# EAGLE design v1 (EAGLE 6.4)
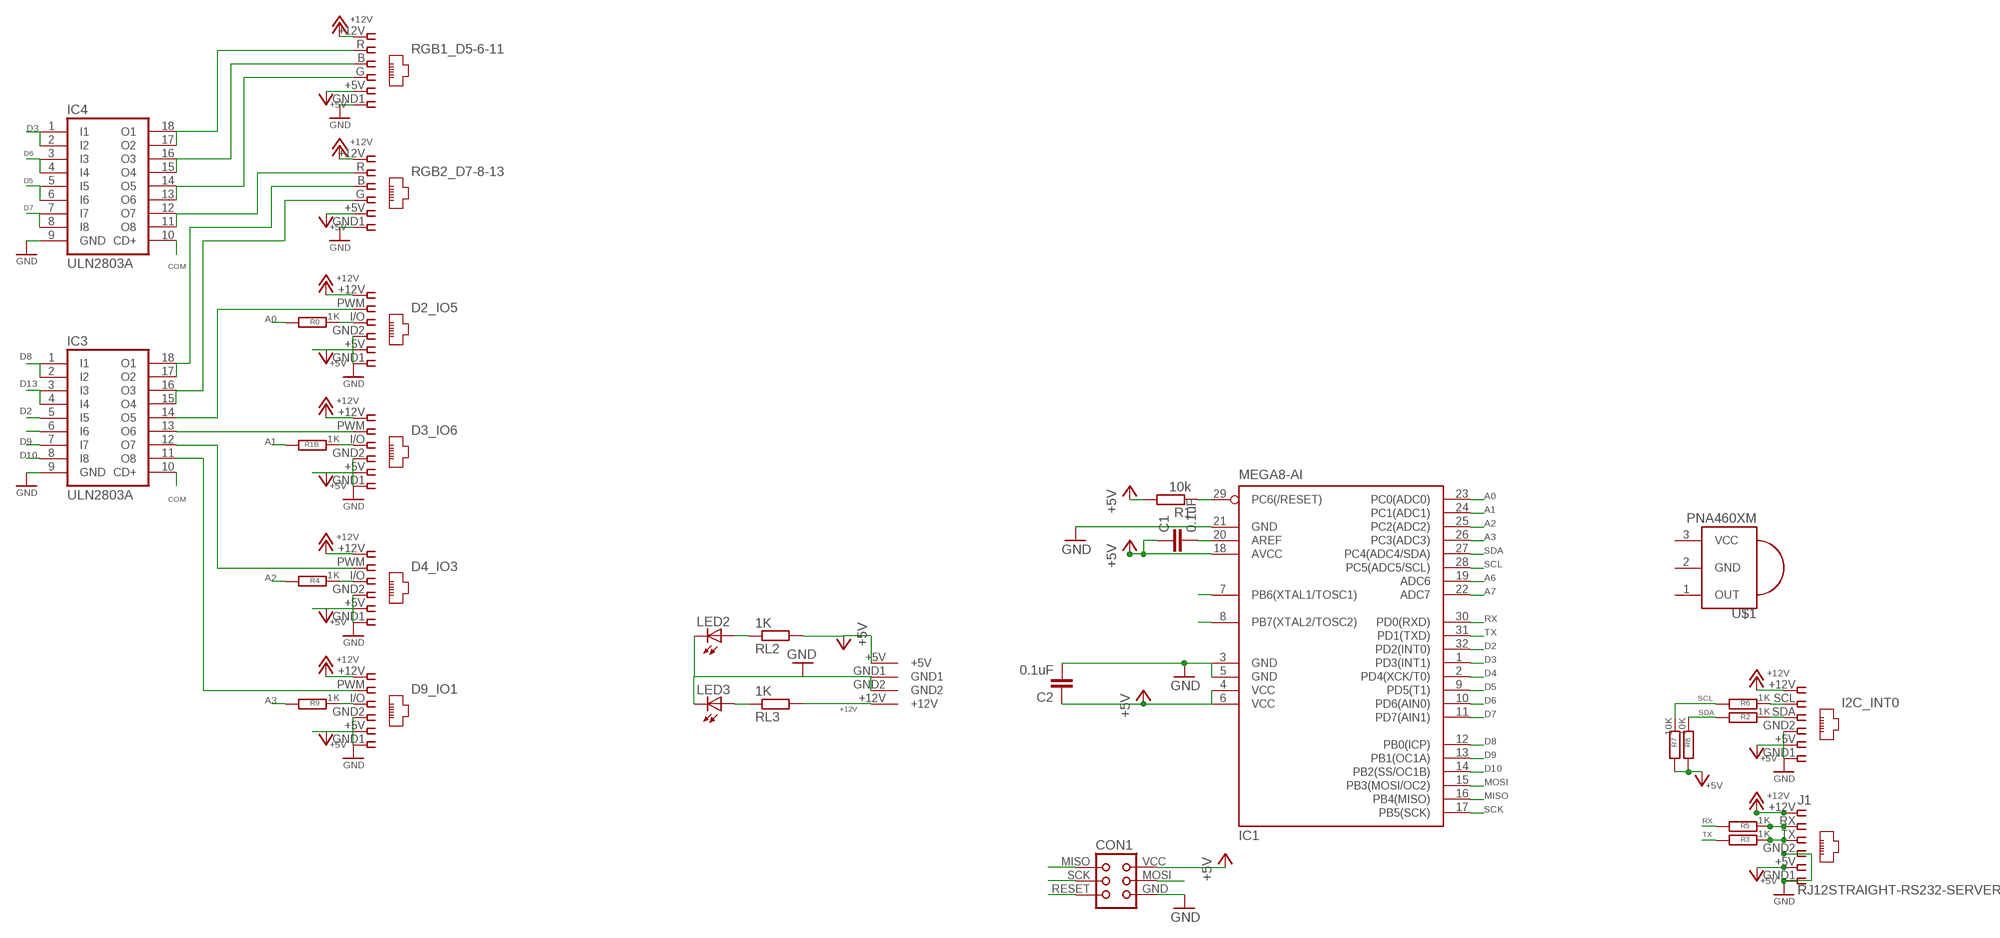
[diagram p0: schematic, sheet 1]

## Parts
C1  0.1uF  C-EUC1206  [C1206]
C2  0.1uF  C-EUC1206  [C1206]
CON1  TINYISP  [TINYISP]
D2_IO5  IO5  RJ12STRAIGHT  [RJ12-STRAIGHT]
D3_IO6  IO6  RJ12STRAIGHT  [RJ12-STRAIGHT]
D4_IO3  IO3  RJ12STRAIGHT  [RJ12-STRAIGHT]
D9_IO1  IO1  RJ12STRAIGHT  [RJ12-STRAIGHT]
I2C_INT0  I2C  RJ12STRAIGHT-I2C  [RJ12-STRAIGHT-I2C]
IC1  MEGA8-AI  [TQFP32-08]
IC3  ULN2803A  [SO18W]
IC4  ULN2803A  [SO18W]
J1  RJ12STRAIGHT-RS232-SERVER  [RJ12-STRAIGHT-RS232]
LED2  LED3MM  [LED3MM]
LED3  LED3MM  [LED3MM]
R0  1K  R-EU_M1206  [M1206]
R1  10k  R-EU_M1206  [M1206]
R1B  1K  R-EU_M1206  [M1206]
R2  1K  R-EU_M1206  [M1206]
R3  1K  R-EU_M1206  [M1206]
R4  1K  R-EU_M1206  [M1206]
R5  1K  R-EU_M1206  [M1206]
R6  1K  R-EU_M1206  [M1206]
R7  10K  R-EU_M1206  [M1206]
R8  10K  R-EU_M1206  [M1206]
R9  1K  R-EU_M1206  [M1206]
RGB1_D5-6-11  RGB1  RJ12STRAIGHT-RGB  [RJ12-STRAIGHT-RGB]
RGB2_D7-8-13  RGB2  RJ12STRAIGHT-RGB  [RJ12-STRAIGHT-RGB]
RL2  1K  R-EU_M1206  [M1206]
RL3  1K  R-EU_M1206  [M1206]
U$1  PNA460XM  [PNA460XM]
U$2  KPJX-4S-S  [KPJX-4S-S]

## Nets
+5V [power]: C1.1 C2.1 CON1.VCC D2_IO5.+5V D3_IO6.+5V D4_IO3.+5V D9_IO1.+5V I2C_INT0.+5V IC1.4(VCC) IC1.6(VCC) IC1.18(AVCC) J1.+5V R1.2 R7.2 R8.2 RGB1_D5-6-11.+5V RGB2_D7-8-13.+5V RL2.2 U$2.+5V
+12V [highpower]: D2_IO5.+12V D3_IO6.+12V D4_IO3.+12V D9_IO1.+12V I2C_INT0.+12V J1.+12V RGB1_D5-6-11.+12V RGB2_D7-8-13.+12V RL3.2 U$2.+12V
A0: IC1.23(PC0(ADC0)) R0.2
A1: IC1.24(PC1(ADC1)) R1B.2
A2: IC1.25(PC2(ADC2)) R4.2
A3: IC1.26(PC3(ADC3)) R9.2
A6: IC1.19(ADC6)
A7: IC1.22(ADC7)
COM: IC3.10(CD+) IC4.10(CD+)
D2: IC1.32(PD2(INT0)) IC3.5(I5)
D2B: D4_IO3.I/O R4.1
D2B1: D9_IO1.I/O R9.1
D2B4: I2C_INT0.SDA R2.1
D2B5: J1.TX R3.1
D2B6: D2_IO5.I/O R0.1
D2B7: D3_IO6.I/O R1B.1
D3: IC1.1(PD3(INT1)) IC4.1(I1) IC4.2(I2)
D4: IC1.2(PD4(XCK/T0))
D5: IC1.9(PD5(T1)) IC4.5(I5) IC4.6(I6)
D6: IC1.10(PD6(AIN0)) IC4.3(I3) IC4.4(I4)
D7: IC1.11(PD7(AIN1)) IC4.7(I7) IC4.8(I8)
D8: IC1.12(PB0(ICP)) IC3.1(I1) IC3.2(I2)
D9: IC1.13(PB1(OC1A)) IC3.7(I7)
D10: IC1.14(PB2(SS/OC1B)) IC3.8(I8)
D13: IC3.3(I3) IC3.4(I4)
GND [power]: C2.2 CON1.GND D2_IO5.GND1 D2_IO5.GND2 D3_IO6.GND1 D3_IO6.GND2 D4_IO3.GND1 D4_IO3.GND2 D9_IO1.GND1 D9_IO1.GND2 I2C_INT0.GND1 I2C_INT0.GND2 IC1.3(GND) IC1.5(GND) IC1.21(GND) IC3.9(GND) IC4.9(GND) J1.GND1 J1.GND2 LED2.K(C) LED3.K(C) RGB1_D5-6-11.GND1 RGB2_D7-8-13.GND1 U$2.GND1 U$2.GND2
MISO: CON1.MISO IC1.16(PB4(MISO))
MOSI: CON1.MOSI IC1.15(PB3(MOSI/OC2))
N$1: IC3.6(I6)
N$2: D3_IO6.PWM IC3.13(O6)
N$4: C1.2 IC1.20(AREF)
N$22 [power]: D4_IO3.PWM IC3.12(O7)
N$26: IC1.7(PB6(XTAL1/TOSC1))
N$27: IC1.8(PB7(XTAL2/TOSC2))
N$48 [power]: IC3.17(O2) IC3.18(O1) RGB2_D7-8-13.B
N$49 [power]: IC4.17(O2) IC4.18(O1) RGB1_D5-6-11.R
N$50 [power]: IC4.15(O4) IC4.16(O3) RGB1_D5-6-11.B
N$51 [power]: D9_IO1.PWM IC3.11(O8)
N$57 [power]: IC3.15(O4) IC3.16(O3) RGB2_D7-8-13.G
N$60 [power]: D2_IO5.PWM IC3.14(O5)
N$68 [power]: IC4.13(O6) IC4.14(O5) RGB1_D5-6-11.G
N$69 [power]: IC4.11(O8) IC4.12(O7) RGB2_D7-8-13.R
N$70: J1.RX R5.1
N$71: I2C_INT0.SCL R6.1
N$75: LED3.A RL3.1
N$76: LED2.A RL2.1
RESET: CON1.RESET IC1.29(PC6(/RESET)) R1.1
RX: IC1.30(PD0(RXD)) R5.2
SCK: CON1.SCK IC1.17(PB5(SCK))
SCL: IC1.28(PC5(ADC5/SCL)) R6.2 R7.1
SDA: IC1.27(PC4(ADC4/SDA)) R2.2 R8.1
TX: IC1.31(PD1(TXD)) R3.2
Unconnected: U$1.1(OUT)

## Power pins joined to a net without a drawn wire
GND: U$1.2(GND)
VCC: U$1.3(VCC)

## Library data of the parts
C1 C2 = resistor:C-EU: CAPACITOR, European symbol
CON1 = lpatiny:TINYISP: CONNECTOR; OC_FARNELL: unknown; OC_NEWARK: unknown
D2_IO5 D3_IO6 D4_IO3 D9_IO1 I2C_INT0 J1 RGB1_D5-6-11 RGB2_D7-8-13 = lpatiny:RJ12: CORCOM Modular RJ Jacks No Shield Source: www.tycoelectronics.com .. ENG_DS_1654001_1099_RJ_L_0507.pdf
IC1 = atmel:MEGA8: MICROCONTROLLER 8 Kbytes FLASH, 1 kbytes SRAM, 512 bytes EEPROM, USART, 6-channel 10 bit ADC, 2-channel 8 bit ADC Pin compatible with Atmega48, ATMega88, ATMega168 Source: avr.lbr; MPN: ATMEGA8-16AU; OC_FARNELL: 9171371; OC_NEWARK: 73M8863
IC3 IC4 = lpatiny:ULN2803A: DRIVER ARRAY
LED2 LED3 = lpatiny:LED3MM
R0 R1 R1B R2-R9 RL2 RL3 = resistor:R-EU_: RESISTOR, European symbol
U$1 = adafruit:PNA460XM: IR 38KHz receiver PNA4602 and related receivers http://www.ladyada.net/library/pcb/eaglelibrary.html
U$2 = lpatiny:KPJX-4S-S

## Net classes
0 default: width 0.203 mm
1 power: width 0.457 mm
2 highpower: width 0.61 mm

## Board
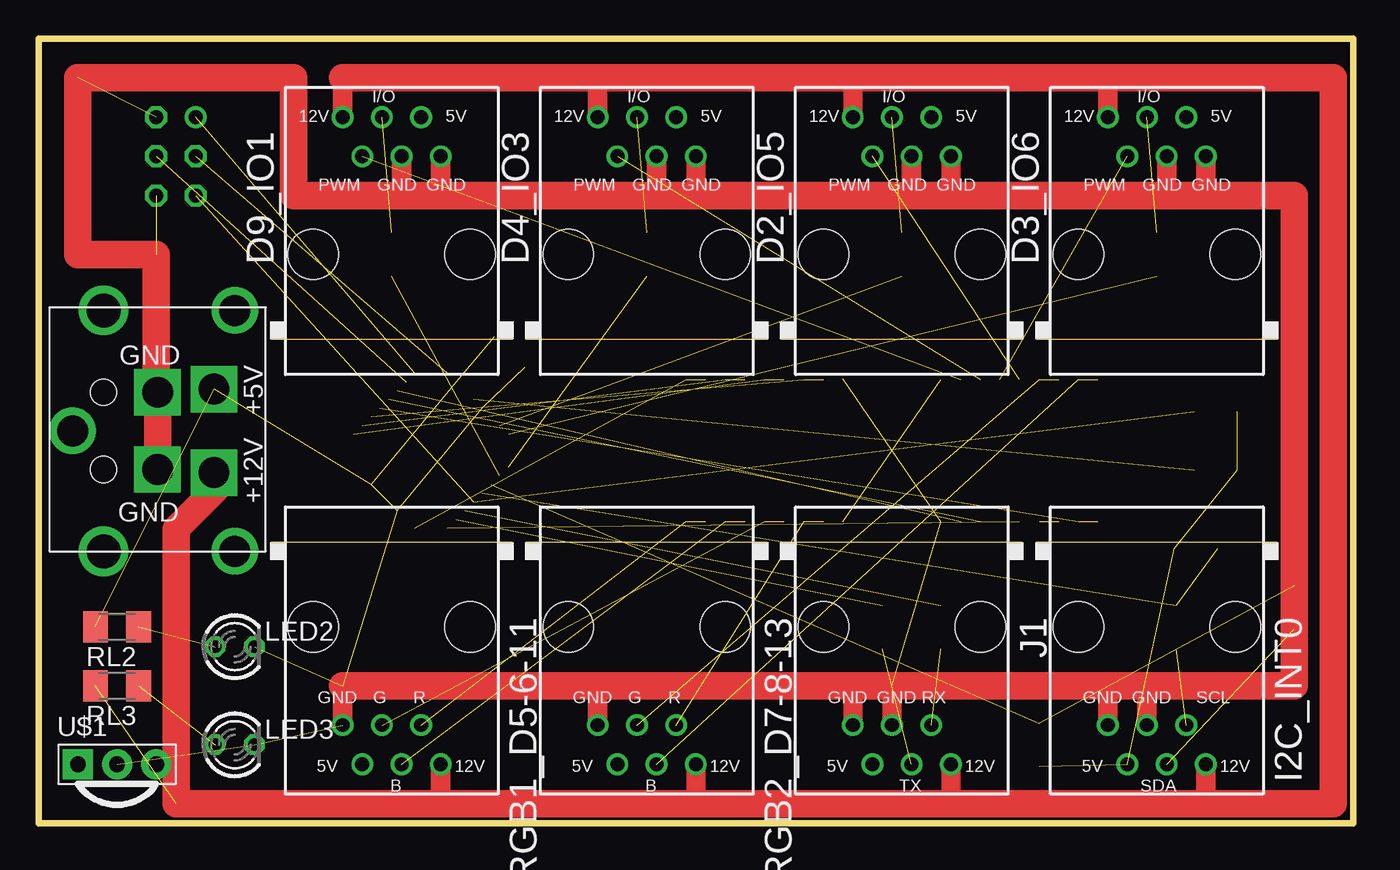
[diagram p1: board, top side]
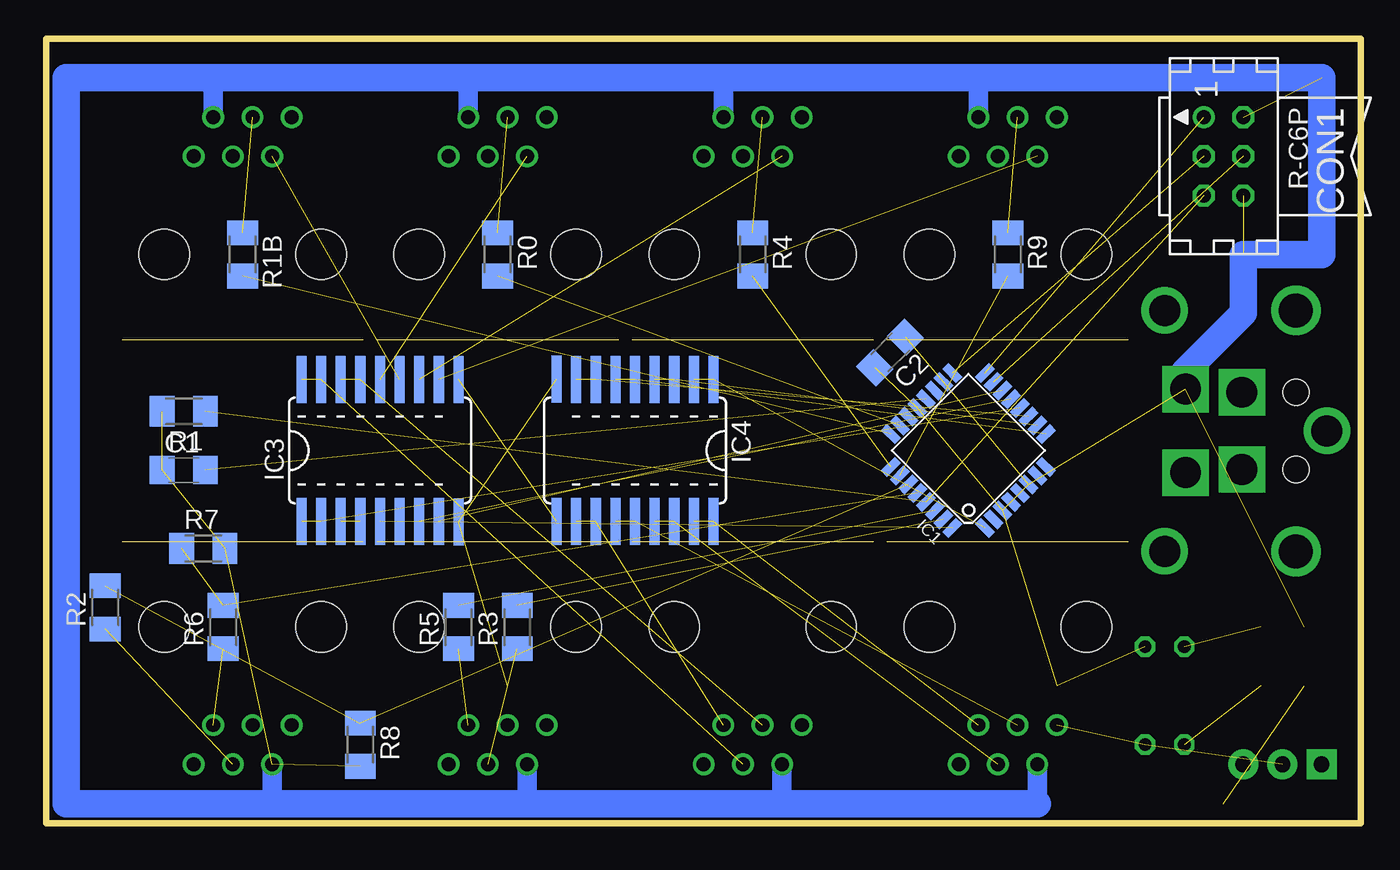
[diagram p2: board, bottom side, seen from below]

Size 85.09 x 50.8 mm. Coordinates in mm from the lower left corner, seen from the top.
Outline: 0,0 0,50.8 85.09,50.8 85.09,0 0,0
Copper layers (1*16): Top 0.035mm / dielectric 1.5mm / Bottom 0.035mm
Design rules "default": minimum track width 10mil, minimum drill 24mil, track to track 8mil, track to pad 8mil, pad to pad 8mil, via to via 8mil, smd to smd 8mil, copper to edge 40mil, drill to drill 8mil, minimum pad ring 10mil, minimum via ring 8mil, stop-mask expansion 4mil, vias tented up to drill 0mil, thermal gap 10mil
vRestrict: area 88.9,22.9 to 101.6,35.6

### Footprints (pad centres in the part's own frame; a part is rotated, then mirrored left to right if it is on the bottom)
C1206 = smd 1.6 x 1.8: 1 -1.4,0; 2 1.4,0
TINYISP = drill 0.914 octagon: GND 2.54,1.27; MOSI 0,1.27; RESET 2.54,-1.27; SCK 0,-1.27; VCC -2.54,1.27 | drill 0.914: MISO -2.54,-1.27
RJ12-STRAIGHT = drill 0.9 pad 1.4: +5V 1.905,8.89; +12V -3.175,8.89; GND1 3.175,6.35; GND2 0.635,6.35; I/O -0.635,8.89; PWM -1.905,6.35 | hole 3.251: -5.08,0; 5.08,0
RJ12-STRAIGHT-I2C = drill 0.9 pad 1.4: +5V 1.905,8.89; +12V -3.175,8.89; GND1 3.175,6.35; GND2 0.635,6.35; SCL -1.905,6.35; SDA -0.635,8.89 | hole 3.251: -5.08,0; 5.08,0
TQFP32-08 = smd 1.27 x 0.559: 1 -4.293,2.8; 2 -4.293,2; 3 -4.293,1.2; 4 -4.293,0.4; 5 -4.293,-0.4; 6 -4.293,-1.2; 7 -4.293,-2; 8 -4.293,-2.8; 17 4.293,-2.8; 18 4.293,-2; 19 4.293,-1.2; 20 4.293,-0.4; 21 4.293,0.4; 22 4.293,1.2; 23 4.293,2; 24 4.293,2.8 | smd 0.559 x 1.27: 9 -2.8,-4.293; 10 -2,-4.293; 11 -1.2,-4.293; 12 -0.4,-4.293; 13 0.4,-4.293; 14 1.2,-4.293; 15 2,-4.293; 16 2.8,-4.293; 25 2.8,4.293; 26 2,4.293; 27 1.2,4.293; 28 0.4,4.293; 29 -0.4,4.293; 30 -1.2,4.293; 31 -2,4.293; 32 -2.8,4.293
SO18W = smd 0.66 x 3.048: 1 -5.08,-4.585; 2 -3.81,-4.585; 3 -2.54,-4.585; 4 -1.27,-4.585; 5 0,-4.585; 6 1.27,-4.585; 7 2.54,-4.585; 8 3.81,-4.585; 9 5.08,-4.623; 10 5.08,4.585; 11 3.81,4.585; 12 2.54,4.585; 13 1.27,4.585; 14 0,4.585; 15 -1.27,4.585; 16 -2.54,4.585; 17 -3.81,4.585; 18 -5.08,4.585
RJ12-STRAIGHT-RS232 = drill 0.9 pad 1.4: +5V 1.905,8.89; +12V -3.175,8.89; GND1 3.175,6.35; GND2 0.635,6.35; RX -1.905,6.35; TX -0.635,8.89 | hole 3.251: -5.08,0; 5.08,0
LED3MM = drill 0.813 octagon: A -1.27,0; K 1.27,0
M1206 = smd 1.6 x 2: 1 -1.4,0; 2 1.4,0
RJ12-STRAIGHT-RGB = drill 0.9 pad 1.4: +5V 1.905,8.89; +12V -3.175,8.89; B -0.635,8.89; G 0.635,6.35; GND1 3.175,6.35; R -1.905,6.35 | hole 3.251: -5.08,0; 5.08,0
PNA460XM = drill 1.016 pad 1.93 square: 1 -2.54,0 | drill 1.016 pad 1.93: 2 0,0; 3 2.54,0
KPJX-4S-S = drill 2 square: +5V 2.7,1.35; +12V -2.7,1.35; GND1 -2.5,5; GND2 2.5,5 | drill 2: P$1 -7.8,0; P$2 7.8,0; P$11 0,10.5 | drill 2.2: P$3 -7.8,8.5; P$4 7.8,8.5 | hole 1.7: -2.5,8.5; 2.5,8.5

### Placement (x,y rotation side)
C1  76.2,22.86 0 bottom
C2  30.48,30.48 225 bottom
CON1  8.89,43.18 270 bottom
D2_IO5  55.88,36.83 0 top
D3_IO6  72.39,36.83 0 top
D4_IO3  39.37,36.83 0 top
D9_IO1  22.86,36.83 0 top
I2C_INT0  72.39,12.7 180 top
IC1  25.4,24.13 135 bottom
IC3  63.5,24.13 0 bottom
IC4  46.99,24.13 180 bottom
J1  55.88,12.7 180 top
LED2  12.7,11.43 0 top
LED3  12.7,5.08 0 top
R0  55.88,36.83 270 bottom
R1  76.2,26.67 180 bottom
R1B  72.39,36.83 270 bottom
R2  81.28,13.97 90 bottom
R3  54.61,12.7 90 bottom
R4  39.37,36.83 270 bottom
R5  58.42,12.7 90 bottom
R6  73.66,12.7 90 bottom
R7  74.93,17.78 0 bottom
R8  64.77,5.08 270 bottom
R9  22.86,36.83 270 bottom
RGB1_D5-6-11  22.86,12.7 180 top
RGB2_D7-8-13  39.37,12.7 180 top
RL2  5.08,12.7 180 top
RL3  5.08,8.89 180 top
U$1  5.08,3.81 0 top
U$2  12.7,25.4 90 top

### Tracks (layer width: path | path; a pad name or v marks a point on that pad's centre or on a via)
+5V  (10 unrouted)
  Bottom 1.27: 20.95,1.27 RGB1_D5-6-11.+5V | RGB2_D7-8-13.+5V 37.47,1.27 | J1.+5V 53.98,1.27 | I2C_INT0.+5V 70.48,1.27 | D3_IO6.+5V 74.3,48.26 | D2_IO5.+5V 57.78,48.26 | D4_IO3.+5V 41.27,48.26 | D9_IO1.+5V 24.77,48.26
  Bottom 1.778: U$2.+5V 11.35,29.29 7.62,33.02 7.62,36.83 2.54,36.83 2.54,48.26 24.77,48.26 41.27,48.26 57.78,48.26 74.3,48.26 83.82,48.26 83.82,1.27 70.48,1.27 53.98,1.27 37.47,1.27 20.95,1.27
+12V  (1 unrouted)
  Top 1.27: 19.68,48.26 D9_IO1.+12V | D4_IO3.+12V 36.2,48.26 | RGB1_D5-6-11.+12V 26.04,1.27 | RGB2_D7-8-13.+12V 42.55,1.27 | J1.+12V 59.05,1.27 | I2C_INT0.+12V 75.56,1.27 | D3_IO6.+12V 69.22,48.26 | D2_IO5.+12V 52.7,48.26
  Top 1.778: U$2.+12V 11.35,21.51 8.89,19.05 8.89,1.27 26.04,1.27 42.55,1.27 59.05,1.27 75.56,1.27 83.82,1.27 83.82,48.26 69.22,48.26 52.7,48.26 36.2,48.26 19.68,48.26
A0  (1 unrouted)
A1  (1 unrouted)
A2  (1 unrouted)
A3  (1 unrouted)
COM  (1 unrouted)
D2  (1 unrouted)
D2B  (1 unrouted)
D2B1  (1 unrouted)
D2B4  (1 unrouted)
D2B5  (1 unrouted)
D2B6  (1 unrouted)
D2B7  (1 unrouted)
D3  (2 unrouted)
D5  (2 unrouted)
D6  (2 unrouted)
D7  (2 unrouted)
D8  (2 unrouted)
D9  (1 unrouted)
D10  (1 unrouted)
D13  (1 unrouted)
GND  (10 unrouted)
  Top 1.27: U$2.GND2 7.62,27.9 | 19.68,8.89 RGB1_D5-6-11.GND1 | RGB2_D7-8-13.GND1 36.2,8.89 | J1.GND1 52.7,8.89 | I2C_INT0.GND1 69.22,8.89 | J1.GND2 55.24,8.89 | I2C_INT0.GND2 71.75,8.89 | D3_IO6.GND2 73.03,40.64 | D3_IO6.GND1 75.56,40.64 | D2_IO5.GND1 59.05,40.64 | D2_IO5.GND2 56.52,40.64 | D4_IO3.GND1 42.55,40.64 | D4_IO3.GND2 40.01,40.64 | D9_IO1.GND1 26.04,40.64 | D9_IO1.GND2 23.5,40.64
  Top 1.778: U$2.GND1 U$2.GND2 | 7.62,27.9 7.62,36.83 2.54,36.83 2.54,48.26 16.51,48.26 16.51,40.64 23.5,40.64 26.04,40.64 40.01,40.64 42.55,40.64 56.52,40.64 59.05,40.64 73.03,40.64 75.56,40.64 81.28,40.64 81.28,8.89 71.75,8.89 69.22,8.89 55.24,8.89 52.7,8.89 36.2,8.89 19.68,8.89
MISO  (1 unrouted)
MOSI  (1 unrouted)
N$2  (1 unrouted)
N$4  (1 unrouted)
N$22  (1 unrouted)
N$48  (2 unrouted)
N$49  (2 unrouted)
N$50  (2 unrouted)
N$51  (1 unrouted)
N$57  (2 unrouted)
N$60  (1 unrouted)
N$68  (2 unrouted)
N$69  (2 unrouted)
N$70  (1 unrouted)
N$71  (1 unrouted)
N$75  (1 unrouted)
N$76  (1 unrouted)
RESET  (2 unrouted)
RX  (1 unrouted)
SCK  (1 unrouted)
SCL  (2 unrouted)
SDA  (2 unrouted)
TX  (1 unrouted)